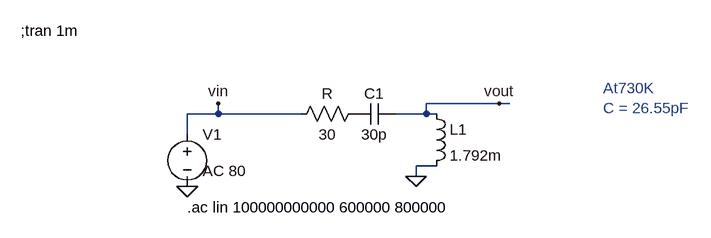
[diagram p0: schematic LC Frequency Analysis.asc]
LC Frequency Analysis.asc, the LTspice schematic file:
Version 4
SHEET 1 880 680
WIRE 448 64 336 64
WIRE 464 64 448 64
WIRE 16 80 16 64
WIRE 16 80 -32 80
WIRE 144 80 16 80
WIRE 336 80 336 64
WIRE 336 80 288 80
WIRE 352 80 336 80
WIRE -32 112 -32 80
WIRE 352 160 320 160
WIRE 320 176 320 160
WIRE -32 192 -32 176
FLAG 320 176 0
FLAG -32 192 0
FLAG 16 64 vin
FLAG 448 64 vout
SYMBOL cap 288 64 R90
WINDOW 0 0 32 VBottom 2
WINDOW 3 32 32 VTop 2
SYMATTR InstName C1
SYMATTR Value 30p
SYMBOL ind 336 64 R0
SYMATTR InstName L1
SYMATTR Value 1.792m
SYMBOL voltage -32 96 R0
WINDOW 3 24 44 Left 2
WINDOW 123 24 72 Left 2
WINDOW 39 0 0 Left 0
SYMATTR Value ""
SYMATTR Value2 AC 80
SYMATTR InstName V1
SYMBOL res 240 64 R90
WINDOW 0 0 56 VBottom 2
WINDOW 3 32 56 VTop 2
SYMATTR InstName R
SYMATTR Value 30
TEXT -32 224 Left 2 !.ac lin 100000000000 600000 800000
TEXT -288 -48 Left 2 !;tran 1m
TEXT 608 40 Left 2 ;At730K \nC = 26.55pF

The netlist it stands for:
* LC Frequency Analysis.asc
C1 vout P001 30p
L1 vout 0 1.792m
V1 vin 0 AC 80
R P001 vin 30
.ac lin 100000000000 600000 800000
;tran 1m
* At730K
* C = 26.55pF
.backanno
.end